# EAGLE design nano relay v2 (EAGLE 9.6.2)
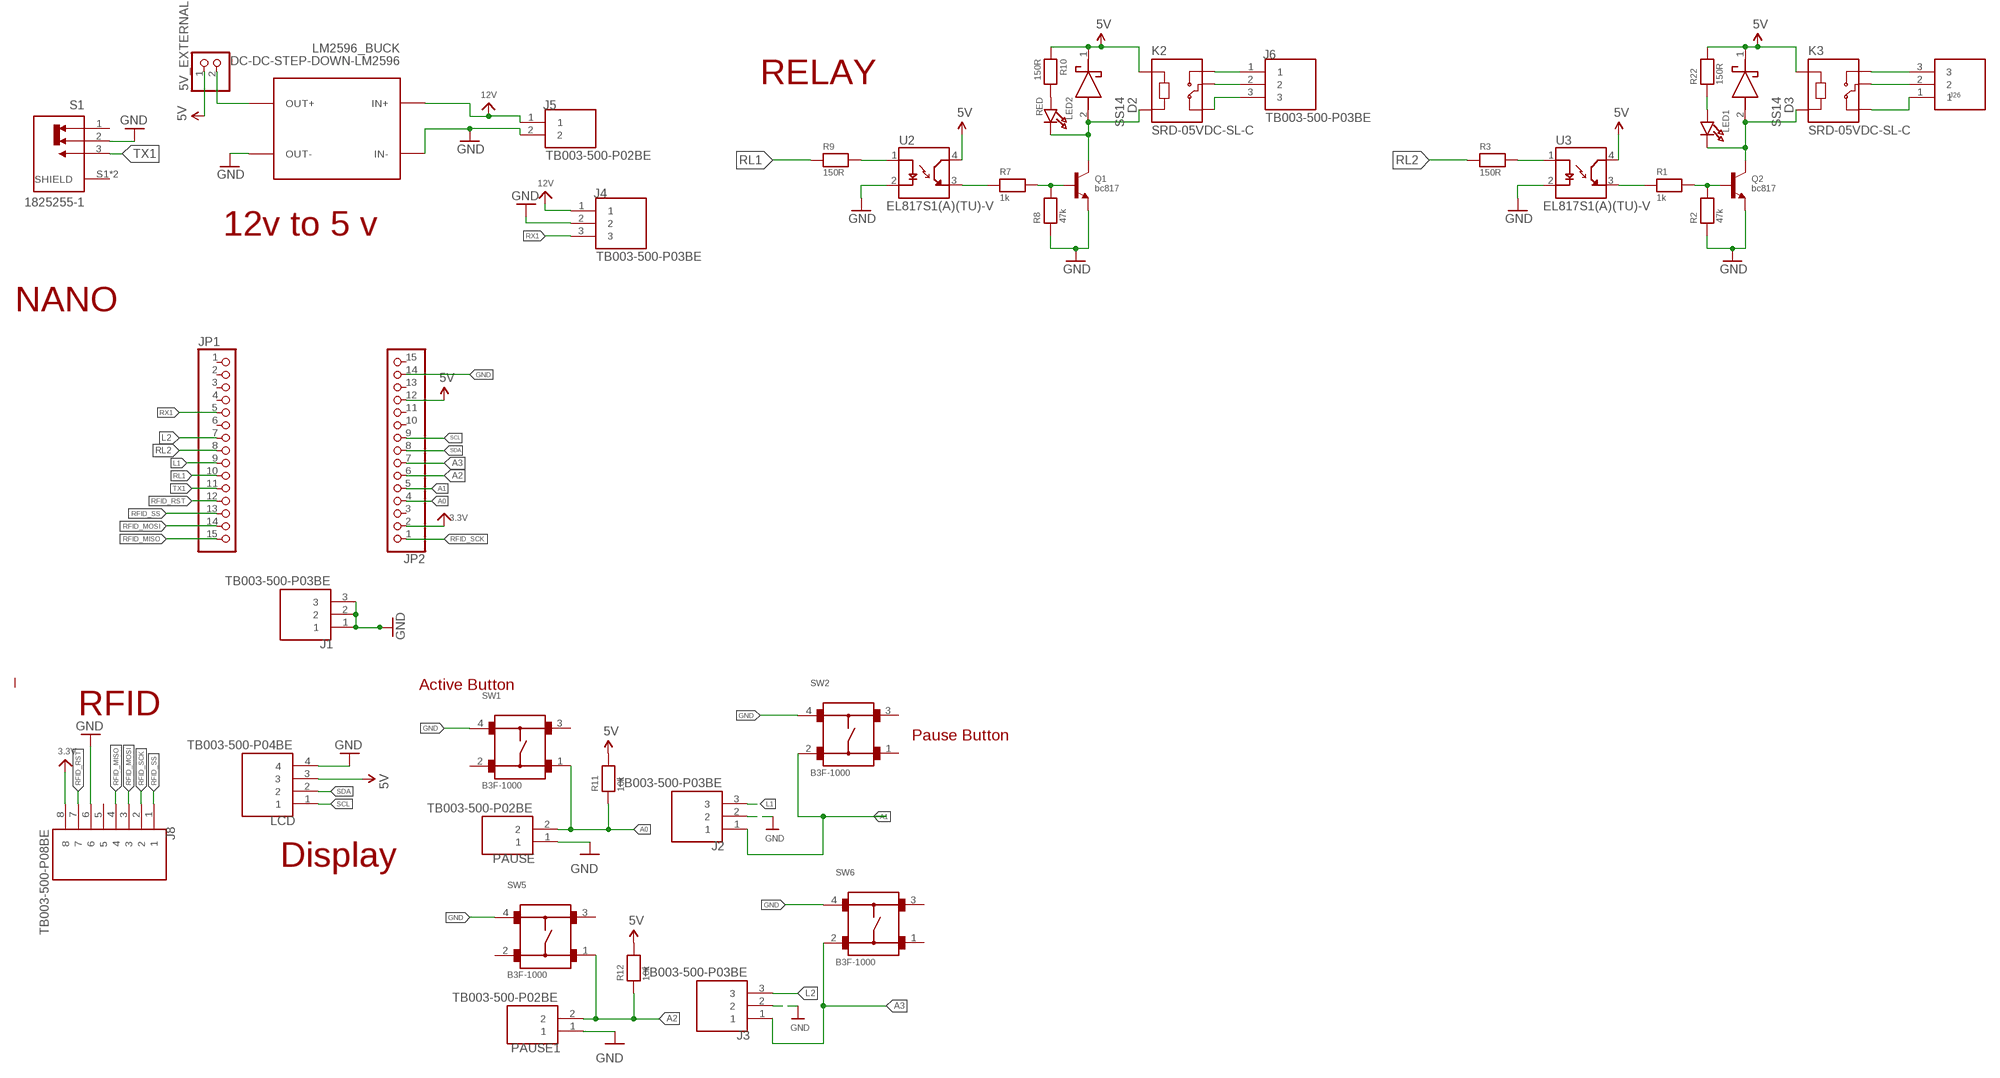
[diagram p0: schematic, sheet 1]

## Parts
5V_EXTERNAL  HEADER-1X2ROUND  [1X02_ROUND]
D2  SS14  [DIOM5227X270N]
D3  SS14  [DIOM5227X270N]
J1  TB003-500-P03BE  [CUI_TB003-500-P03BE]
J2  TB003-500-P03BE  [CUI_TB003-500-P03BE]
J3  TB003-500-P03BE  [CUI_TB003-500-P03BE]
J4  TB003-500-P03BE  [CUI_TB003-500-P03BE]
J5  TB003-500-P02BE  [CUI_TB003-500-P02BE]
J6  TB003-500-P03BE  [CUI_TB003-500-P03BE]
J8  TB003-500-P08BE  [CUI_TB003-500-P08BE]
J26  TB003-500-P03BE  [CUI_TB003-500-P03BE]
JP1  HEADER-1X15  [1X15_ROUND_70]
JP2  HEADER-1X15  [1X15_ROUND_70]
K2  SRD-05VDC-SL-C  [RELAY_SRD-05VDC-SL-C]
K3  SRD-05VDC-SL-C  [RELAY_SRD-05VDC-SL-C]
LCD  TB003-500-P04BE  [CUI_TB003-500-P04BE]
LED1  LED0603  [CHIPLED_0603]
LED2  RED  LED0603  [CHIPLED_0603]
LM2596_BUCK  DC-DC-STEP-DOWN-LM2596  [DC-DC-STEP-DOWN-LM2596]
PAUSE  TB003-500-P02BE  [CUI_TB003-500-P02BE]
PAUSE1  TB003-500-P02BE  [CUI_TB003-500-P02BE]
Q1  bc817  TRANSISTOR_NPN  [SOT23-R]
Q2  bc817  TRANSISTOR_NPN  [SOT23-R]
R1  1k  RESISTOR0603  [0603]
R2  47k  RESISTOR0603  [0603]
R3  150R  RESISTOR0603  [0603]
R7  1k  RESISTOR0603  [0603]
R8  47k  RESISTOR0603  [0603]
R9  150R  RESISTOR0603  [0603]
R10  150R  RESISTOR0402  [0402]
R11  10k  RESISTOR0603  [0603]
R12  10k  RESISTOR0603  [0603]
R22  150R  RESISTOR0402  [0402]
S1  1825255-1  [SW_1825255-1]
SW1  B3F-1000  [B3F-1000]
SW2  B3F-1000  [B3F-1000]
SW5  B3F-1000  [B3F-1000]
SW6  B3F-1000  [B3F-1000]
U2  EL817S1(A)(TU)-V  [SOIC254P1030X390-4N_EL817S1(A)(TU)-V]
U3  EL817S1(A)(TU)-V  [SOIC254P1030X390-4N_EL817S1(A)(TU)-V]

## Nets
3.3V: J8.8 JP2.2
5V: 5V_EXTERNAL.1 D2.1(K) D3.1(K) JP2.12 K2.A1 K3.A1 LCD.3 R10.1 R11.2 R12.2 R22.2 U2.4(CT) U3.4(CT)
12V: J4.1 J5.1 LM2596_BUCK.IN+
A0: JP2.4 PAUSE.2 R11.1 SW1.1
A1: J2.1 JP2.5 SW2.2
A2: JP2.6 PAUSE1.2 R12.1 SW5.1
A3: J3.1 JP2.7 SW6.2
GND: J1.1 J1.2 J1.3 J2.2 J3.2 J4.2 J5.2 J8.6 JP2.14 LCD.4 LM2596_BUCK.IN- LM2596_BUCK.OUT- PAUSE1.1 PAUSE.1 Q1.2(E) Q2.2(E) R2.1 R8.1 S1.2 SW1.4 SW2.4 SW5.4 SW6.4 U2.2(C) U3.2(C)
L1: J2.3 JP1.9
L2: J3.3 JP1.7
N$2: J6.1 K2.NO
N$3: LED2.A R10.2
N$5: J6.2 K2.COM
N$11: D2.2(A) K2.A2 LED2.C Q1.3(C)
N$12: Q1.1(B) R7.2 R8.2
N$13: J6.3 K2.NC
N$14: R7.1 U2.3(ET)
N$15: 5V_EXTERNAL.2 LM2596_BUCK.OUT+
N$16: R9.2 U2.1(A)
N$17: D3.2(A) K3.A2 LED1.C Q2.3(C)
N$18: Q2.1(B) R1.2 R2.2
N$19: J26.3 K3.NO
N$21: R1.1 U3.3(ET)
N$22: R3.2 U3.1(A)
N$23: J26.1 K3.NC
N$24: J26.2 K3.COM
N$45: LED1.A R22.1
RFID_MISO: J8.4 JP1.15
RFID_MOSI: J8.3 JP1.14
RFID_RST: J8.7 JP1.12
RFID_SCK: J8.2 JP2.1
RFID_SS: J8.1 JP1.13
RL1: JP1.10 R9.1
RL2: JP1.8 R3.1
RX1: J4.3 JP1.5
SCL: JP2.9 LCD.1
SDA: JP2.8 LCD.2
TX1: JP1.11 S1.3
Unconnected: J8.5 JP1.1 JP1.2 JP1.3 JP1.4 JP1.6 JP2.3 JP2.10 JP2.11 JP2.13 JP2.15 S1.1 S1.S1(SHIELD) S1.S2(SHIELD) SW1.2 SW1.3 SW2.1 SW2.3 SW5.2 SW5.3 SW6.1 SW6.3

## Notes on the sheet
- RELAY
- 12v to 5 v
- NANO
- Active Button
- RFID
- Pause Button
- Display

## Library data of the parts
5V_EXTERNAL = microbuilder:HEADER-1X2: PIN HEADER
D2 D3 = SS14:SS14: 1.0 A Schottky Barrier Rectifiers Source: Datasheet <http://www.onsemi.com/pub/Collateral/SS19-D.pdf>; DESCRIPTION: 1.0 A Schottky Barrier Rectifiers; HEIGHT: 2.7mm; MANUFACTURER_NAME: ON Semiconductor; MANUFACTURER_PART_NUMBER: SS14; MOUSER_PART_NUMBER: 512-SS14; MOUSER_PRICE-STOCK: https://www.mouser.com/Search/Refine.aspx?Keyword=512-SS14; RS_PART_NUMBER: 7390467P; RS_PRICE-STOCK: http://uk.rs-online.com/web/p/products/7390467P
J1-J4 J6 J26 = TB003-500-P03BE:TB003-500-P03BE: Check prices <https://pricing.snapeda.com/parts/TB003-500-P03BE/CUI%20Devices/view-part?ref=eda>; AVAILABILITY: Good; CUI_PURCHASE_URL: https://www.cuidevices.com/product/interconnect/connectors/terminal-blocks/tb003-500-series?utm_source=snapeda.com&utm_medium=referral&utm_campaign=snapedaBOM; DESCRIPTION: 2~24 Poles, Screw Type, Horizontal, 5.0 Pitch, 26~14 (AWG), Terminal Block Connector; MF: CUI Devices; MP: TB003-500-P03BE; PACKAGE: None; PRICE: None; PURCHASE-URL: https://pricing.snapeda.com/search/part/TB003-500-P03BE/?ref=eda
J5 PAUSE PAUSE1 = TB003-500-P02BE:TB003-500-P02BE: Check prices <https://pricing.snapeda.com/parts/TB003-500-P02BE/CUI%20Devices/view-part?ref=eda>; AVAILABILITY: Good; CUI_PURCHASE_URL: https://www.cuidevices.com/product/interconnect/connectors/terminal-blocks/tb003-500-series?utm_source=snapeda.com&utm_medium=referral&utm_campaign=snapedaBOM; DESCRIPTION: 2~24 Poles, Screw Type, Horizontal, 5.0 Pitch, 26~14 (AWG), Terminal Block Connector; MF: CUI Devices; MP: TB003-500-P02BE; PACKAGE: None; PRICE: None; PURCHASE-URL: https://pricing.snapeda.com/search/part/TB003-500-P02BE/?ref=eda
J8 = TB003-500-P08BE:TB003-500-P08BE: Check prices <https://pricing.snapeda.com/parts/TB003-500-P08BE/CUI%20Devices/view-part?ref=eda>; AVAILABILITY: Good; CUI_PURCHASE_URL: https://www.cuidevices.com/product/interconnect/connectors/terminal-blocks/tb003-500-series?utm_source=snapeda.com&utm_medium=referral&utm_campaign=snapedaBOM; DESCRIPTION: 2~24 Poles, Screw Type, Horizontal, 5.0 Pitch, 26~14 (AWG), Terminal Block Connector; MF: CUI Devices; MP: TB003-500-P08BE; PACKAGE: None; PRICE: None; PURCHASE-URL: https://pricing.snapeda.com/search/part/TB003-500-P08BE/?ref=eda
JP1 JP2 = microbuilder:HEADER-1X15: 1x15 Header
K2 K3 = SRD-05VDC-SL-C:SRD-05VDC-SL-C: 5V Trigger Relay Module For Arduino And Raspberry Pi 5V Trigger Relay Module For Arduino And Raspberry Pi; AVAILABILITY: Unavailable; DESCRIPTION: 5V Trigger Relay Module For Arduino And Raspberry Pi 5V Trigger Relay Module For Arduino And Raspberry Pi; MF: Songle Relay; MP: SRD-05VDC-SL-C; PACKAGE: None; PRICE: None
LCD = TB003-500-P04BE:TB003-500-P04BE: Check prices <https://pricing.snapeda.com/parts/TB003-500-P04BE/CUI%20Devices/view-part?ref=eda>; AVAILABILITY: Good; CUI_PURCHASE_URL: https://www.cuidevices.com/product/interconnect/connectors/terminal-blocks/tb003-500-series?utm_source=snapeda.com&utm_medium=referral&utm_campaign=snapedaBOM; DESCRIPTION: 2~24 Poles, Screw Type, Horizontal, 5.0 Pitch, 26~14 (AWG), Terminal Block Connector; MF: CUI Devices; MP: TB003-500-P04BE; PACKAGE: None; PRICE: None; PURCHASE-URL: https://pricing.snapeda.com/search/part/TB003-500-P04BE/?ref=eda
LED1 LED2 = microbuilder:LED: LED 0603 - 0603 Surface Mount Package 2mA: Green LED - Low Power (3.9mcd, 2ma, 1.7Vf) - Digikey: 475-2709-2-ND Orange LED - Low Power (9.8mcd, 2ma, 1.8Vf) - Digikey: 475-1194-2-ND Red LED - Low Power (5mcd, 2ma, 1.8Vf) - Digikey: 475-1195-2-ND Yellow LED - Low Power (7mcd, 2ma, 1.8Vf) - Digikey: 475-1196-2-ND 5mA: Blue LED - Low Power (17mcd, 5ma, 2.9Vf) - Digikey: LNJ937W8CRACT-ND 0805 - 0805 Surface Mount Package 2mA: Red LED (8.8mcd, 2mA, 1.8Vf, Clear) - Low Power [Digikey: 475-2510-1-ND] Green LED (5mcd, 2mA, 1.8Vf, Clear) - Low Power [Digikey: 475-2730-1-ND] Yellow LED (11.3mcd, 2mA, 1.8Vf, Clear) - Low Power [Digikey: 475-2555-1-ND] 20mA: Red LED (104mcd, 20mA, Diffused) - LS R976 [Digikey: 475-1278-6-ND] Red LED (12mcd, 20mA, 2.0Vf, Clear) - APT2012EC [Digikey: 754-1128-1-ND] Green LED (15mcd, 20mA, 2.2Vf, Clear) - APT2012GC [Digikey: 754-1131-1-ND] Orange LED (160mcd, 20mA, 2.1Vf, Clear) - APT2012SECK [Digikey: 754-1130-1-ND] 1206 - 1206 Surface Mount Package Green LED (26mcd, 20mA, Diffused) - LG N971 [Digikey: 475-1407-6-ND] Red LED (15mcd, 20mA, Diffused) - LH N974 [Digikey: 475-1416-6-ND]
LM2596_BUCK = diy-modules:DC-DC-STEP-DOWN-LM2596: DC/DC Step-Down Regulator based on LM2596-ADJ chip LM2596 datasheet available here: http://www.ti.com/lit/ds/symlink/lm2596.pdf Click here to find device on ebay.com <http://www.ebay.com/sch/lm2596+power+regulator>
Q1 Q2 = microbuilder:TRANSISTOR_NPN: NPN Transistor Transistor (NPN) 500mA 45V - BC817 [Digikey: 568-1631-1-ND] Transistor (NPN) 500mA 45V - BC817,215 [Mouser: 771-BC817-T/R] SOT23-R - SOT23 footprint optimised for use with solder paste and reflow ovens. SOT23-W - SOT23 footprint optimised for hand-soldering (larger pads).
R1-R3 R7-R12 R22 = microbuilder:RESISTOR: Resistors 0402 - 0402 Surface Mount Package 22 Ohm 1% 1/16W [Digikey: 311-22.0LRTR-ND] 33 Ohm 5% 1/16W 1.0K 5% 1/16W 1.5K 5% 1/16W 2.0K 1% 1/16W 10.0K 1% 1/16W [Digikey: 311-10.0KLRTR-ND] 10.0K 5% 1/16W [Digikey: RMCF0402JT10K0TR-ND] 12.1K 1% 1/16W [Digikey: 311-22.0LRTR-ND] 100.0K 5% 1/16W 0603 - 0603 Surface Mount Package 0 Ohm 1/10 Watt 1% Resistor 15 Ohm 1/10 Watt 1% Resistor 33 Ohm 1/10 Watt 1% Resistor 49.9 Ohm 1/10 Watt 1% Resistor 100 Ohm 1/10 Watt 1% Resistor 150 Ohm 1/10 Watt 1% Resistor 240 Ohm 1/10 Watt 1% Resistor 390 Ohm 1/10 Watt 1% Resistor 560 Ohm 1/10 Watt 1% Resistor 680 Ohm 1/10 Watt 1% Resistor 750 Ohm 1/10 Watt 1% Resistor 1.0K Ohm 1/10 Watt 1% Resistor 1.5K Ohm 1/10 Watt 1% Resistor 2.0K Ohm 1/10 Watt 1% Resistor 2.2K Ohm 1/10 Watt 1% Resistor 3.3K Ohm 1/10 Watt 1% Resistor 4.7K Ohm 1/10 Watt 1% Resistor 10.0K Ohm 1/10 Watt 1% Resistor 12.0K Ohm 1/10 Watt 1% Resistor 12.1K Ohm 1/10 Watt 1% Resistor 20.0K Ohm 1/10 Watt 1% Resistor 33.0K Ohm 1/10 Watt 1% Resistor 100.0K Ohm 1/10 Watt 1% Resistor 0805 - 0805 Surface Mount Package 0 Ohm 1/8 Watt 1% Resistor 33 Ohm 1/8 Watt 1% Resistor 100 Ohm 1/8 Watt 1% Resistor 150 Ohm 1/8 Watt 1% Resistor 200 Ohm 1/8 Watt 1% Resistor 240 Ohm 1/8 Watt 1% Resistor 330 Ohm 1/8 Watt 1% Resistor 390 Ohm 1/8 Watt 1% Resistor 470 Ohm 1/8 Watt 1% Resistor 1.0K Ohm 1/8 Watt 1% Resistor 1.5K Ohm 1/8 Watt 1% Resistor 2.0K Ohm 1/8 Watt 1% Resistor 4.7K Ohm 1/8 Watt 1% Resistor 5.1K Ohm 1/8 Watt 1% Resistor 5.6K Ohm 1/8 Watt 1% Resistor 10.0K Ohm 1/8 Watt 1% Resistor 22.0K Ohm 1/8 Watt 1% Resistor 33.0K Ohm 1/8 Watt 1% Resistor 100K Ohm 1/8 Watt 1% Resistor 1206 - 1206 Surface Mount Package 2012 - 2010 Surface Mount Package 0.11 Ohm 1/2 Watt 1% Resistor - Digikey: RHM.11UCT-ND
S1 = 1825255-1:1825255-1: Switch Slide ON None ON SPDT Top Slide 0.3A 125VAC PC Pins Thru-Hole Tray; COMMENT: 1825255-1; DESCRIPTION: Switch Slide ON None ON SPDT Top Slide 0.3A 125VAC PC Pins Thru-Hole Tray; DIGI-KEY_PART_NUMBER: 450-1567-ND; MF: TE Connectivity; MP: 1825255-1; PACKAGE: Custom Package TE Connectivity; PURCHASE-URL: https://pricing.snapeda.com/search/part/1825255-1/?ref=eda
SW1 SW2 SW5 SW6 = Switch:B3F-1000: Tactile Switch SPST-NO Top Actuated Through Hole Manufacturer's datasheet <https://omronfs.omron.com/en_US/ecb/products/pdf/en-b3f.pdf>; CREATED_BY: PCBLayout.com; DIGI_KEY_PART_NUMBER: SW400-ND; MANUFACTURER: Omron Electronics Inc-EMC Div; MPN: B3F-1000; PACKAGE: SPST-NO
U2 U3 = EL817S1_A__TU_-V:EL817S1(A)(TU)-V: Optoisoltr 5kv Transistor 4-Smd; DESCRIPTION: Optoisolator Transistor Output 5000Vrms 1 Channel 4-SMD; DIGI-KEY_PART_NUMBER: EL817S1(A)(TU)-V-ND; MF: Everlight Electronics; MP: EL817S1(A)(TU)-V; PACKAGE: SMD-4 Everlight Electronics Co Ltd

## Net classes
0 default: width 0.203 mm, drill 0.406 mm, clearance 0.203 mm

## Board
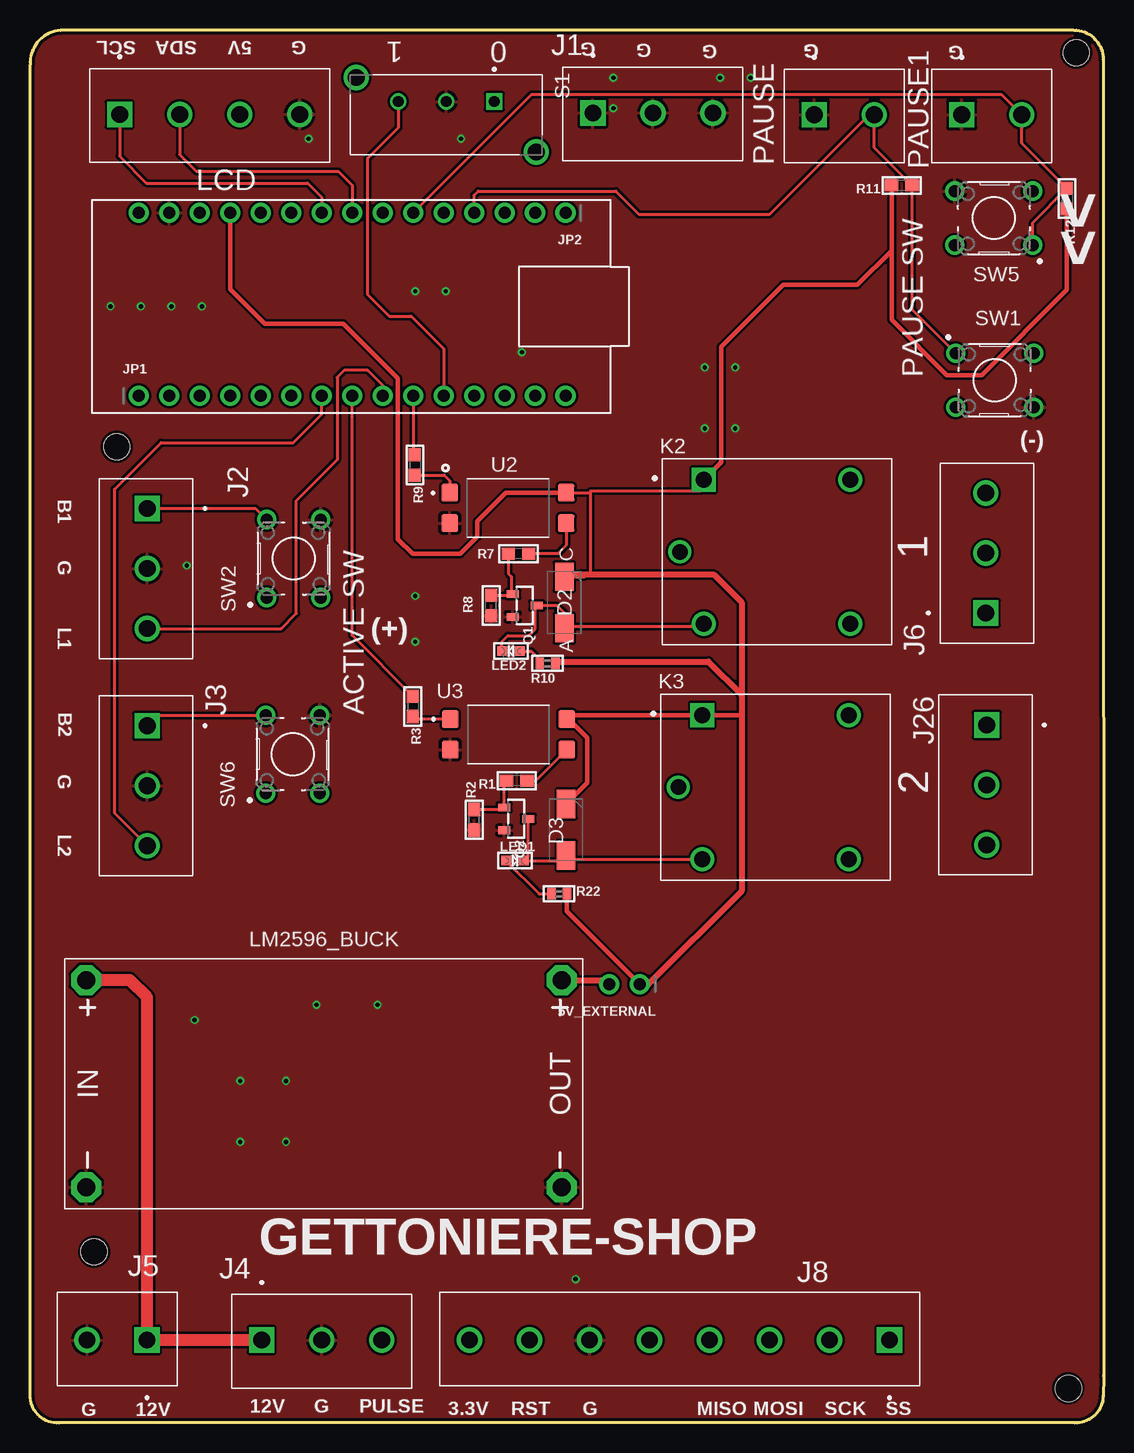
[diagram p1: board, top side]
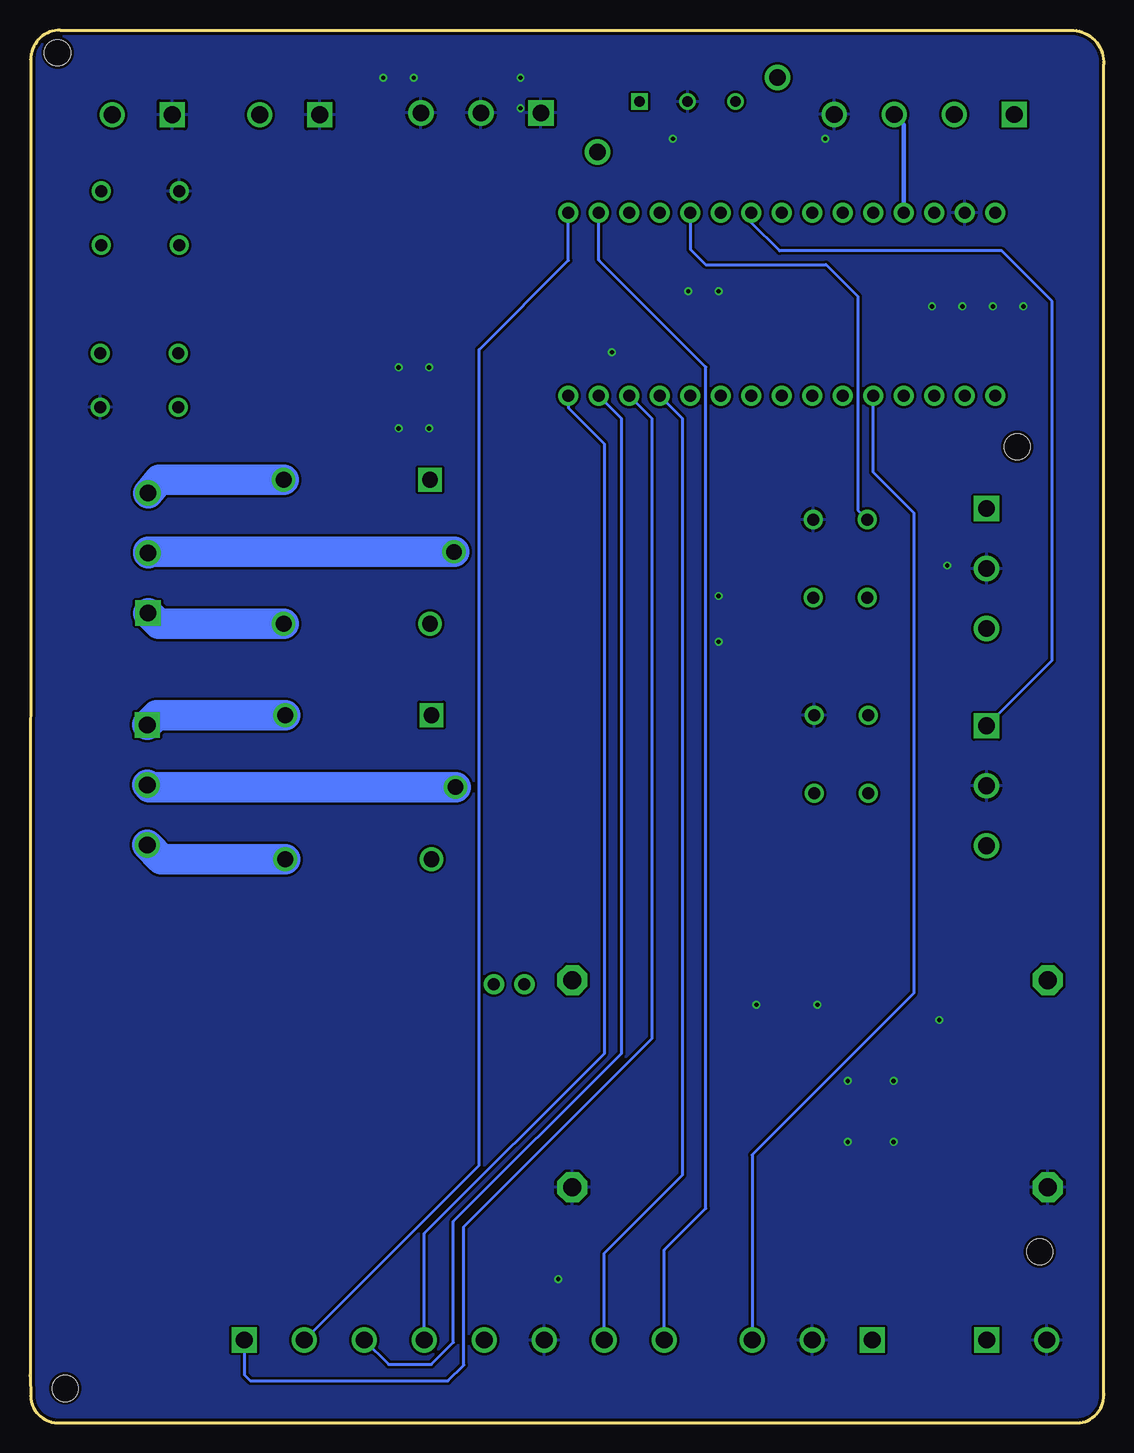
[diagram p2: board, bottom side, seen from below]

Size 89.49 x 116.08 mm. Coordinates in mm from the lower left corner, seen from the top.
Outline: 0.03,2.09 arc89 2.41,0 87.05,0 arc90 89.43,2.24 89.46,3.86 arc90 89.46,4.02 89.43,113.62 arc90 86.97,116.08 2.54,116.05 arc90 0.03,113.18 0.03,2.09
Outline: 0.03,2.09 arc-1 0,2.47
Copper layers (1*16): Top 0.035mm / dielectric 1.5mm / Bottom 0.035mm
Design rules "default *": minimum track width 8mil, minimum drill 0.3mm, track to track 6mil, track to pad 6mil, pad to pad 6mil, via to via 6mil, smd to smd 0mil, copper to edge 10mil, drill to drill 6mil, minimum pad ring 8mil, minimum via ring 6mil, stop-mask expansion 2mil, vias tented up to drill 15mil, thermal gap 10mil
Holes 2.16 mm at 86.54,2.87 87.2,114.2 5.33,14.28 7.21,81.36

### Footprints (pad centres in the part's own frame; a part is rotated, then mirrored left to right if it is on the bottom)
1X02_ROUND = drill 1 pad 1.676: 1 -1.27,0; 2 1.27,0
DIOM5227X270N = smd 2.35 x 1.55: 1 -2.15,0; 2 2.15,0
CUI_TB003-500-P03BE = drill 1.4 square: 1 0,0 | drill 1.4: 2 5,0; 3 10,0
CUI_TB003-500-P02BE = drill 1.4 square: 1 0,0 | drill 1.4: 2 5,0
CUI_TB003-500-P08BE = drill 1.4 square: 1 0,0 | drill 1.4: 2 5,0; 3 10,0; 4 15,0; 5 20,0; 6 25,0; 7 30,0; 8 35,0
1X15_ROUND_70 = drill 1 pad 1.676: 1 -17.78,0; 2 -15.24,0; 3 -12.7,0; 4 -10.16,0; 5 -7.62,0; 6 -5.08,0; 7 -2.54,0; 8 0,0; 9 2.54,0; 10 5.08,0; 11 7.62,0; 12 10.16,0; 13 12.7,0; 14 15.24,0; 15 17.78,0
RELAY_SRD-05VDC-SL-C = drill 1.32 square: A1 -6.1,6 | drill 1.32: A2 -6.1,-6; NC 6.1,6; NO 6.1,-6 | drill 1.29: COM -8.1,0
CUI_TB003-500-P04BE = drill 1.4 square: 1 0,0 | drill 1.4: 2 5,0; 3 10,0; 4 15,0
CHIPLED_0603 = smd 0.8 x 0.8: A 0,-0.75; C 0,0.75
DC-DC-STEP-DOWN-LM2596 = drill 1.5 pad 2.5 octagon: IN+ -19.812,8.636; IN- -19.812,-8.636; OUT+ 19.812,8.636; OUT- 19.812,-8.636
SOT23-R = smd 0.635 x 1.016: 1 -0.95,-1; 2 0.95,-1; 3 0,1
0603 = smd 1.1 x 1: 1 -0.85,0; 2 0.85,0
0402 = smd 0.7 x 0.9: 1 -0.65,0; 2 0.65,0
SW_1825255-1 = drill 0.902 square: 1 -1.1,4 | drill 0.902: 2 -1.1,0; 3 -1.1,-4 | drill 1.402: S1 3.1,7.5; S2 -3.1,-7.5
B3F-1000 = drill 1 pad 1.6: 1 -3.25,2.25; 2 3.25,2.25; 3 -3.25,-2.25; 4 3.25,-2.25
SOIC254P1030X390-4N_EL817S1(A)(TU)-V = smd 1.41 x 1.47: 1 -4.85,1.27; 2 -4.85,-1.27; 3 4.85,-1.27; 4 4.85,1.27

### Placement (x,y rotation side)
5V_EXTERNAL  49.56,36.55 180 top
D2  44.53,68.38 270 top
D3  44.68,49.43 270 top
J1  46.91,109.17 0 top
J2  9.78,76.2 270 top
J3  9.78,58.09 270 top
J4  19.3,6.91 0 top
J5  9.75,6.91 180 top
J6  79.65,67.49 90 top
J8  71.63,6.91 180 top
J26  79.73,58.17 270 top
JP1  26.85,85.6 0 top
JP2  26.85,100.84 180 top
K2  62.26,72.6 0 top
K3  62.13,52.99 0 top
LCD  7.47,109.04 0 top
LED1  40.41,46.87 270 top
LED2  40.08,64.31 90 top
LM2596_BUCK  24.49,28.27 0 top
PAUSE  65.35,109.02 0 top
PAUSE1  77.65,109.02 0 top
Q1  41.22,68.12 270 top
Q2  40.51,50.34 270 top
R1  40.56,53.52 180 top
R2  37.03,50.27 90 top
R3  31.9,59.72 270 top
R7  40.72,72.44 180 top
R8  38.43,68.12 90 top
R9  32.08,79.83 270 top
R10  43.13,63.3 180 top
R11  72.64,103.13 180 top
R12  86.41,102.03 270 top
R22  44.09,44.1 0 top
S1  34.7,109.02 270 top
SW1  80.39,86.9 0 top
SW2  21.97,72.04 90 top
SW5  80.31,100.41 180 top
SW6  21.89,55.73 90 top
U2  39.83,76.25 0 top
U3  39.88,57.38 0 top

### Tracks (layer width: path | path; a pad name or v marks a point on that pad's centre or on a via)
3.3V
  Bottom 0.254: J8.8 36.63,14.43 33.17,17.88 33.17,87.99 42.09,96.9 JP2.2
5V
  Top 0.254: U2.4 46.71,77.52 | K2.A1 56.16,77.9 55.93,77.68 46.71,77.68 46.71,77.52 | D2.1 44.96,70.53 46.24,70.53 46.71,71 46.71,77.52
  Top 0.381: K2.A1 57.6,80.04 57.6,89.69 62.76,94.85 68.94,94.85 71.79,97.7 | 71.79,103.19 R11.2 71.79,97.7 | JP2.12 16.69,94.46 19.56,91.59 26.11,91.59 30.66,87.05 30.66,73.66 31.88,72.44 35.84,72.44 37.26,73.87 37.26,75.14 39.65,77.52 U2.4 | R22.2 44.74,42.63 5V_EXTERNAL.1 | D3.1 46.46,53.36 46.46,57.1 44.91,58.65 U3.4 45.06,58.99 K3.A1 59.23,58.99 59.31,58.9 | R12.2 86.41,94.41 79.32,87.33 76.4,87.33 71.79,91.94 71.79,97.7
  Top 0.508: 59.31,60.68 59.31,58.9 59.31,44.33 51.54,36.55 5V_EXTERNAL.1 51.05,36.55 | 44.96,70.53 45.11,70.68 57.01,70.68 59.31,68.38 59.31,60.68 | R10.1 43.93,63.45 56.54,63.45 59.31,60.68
  Bottom 0.254: LCD.3 17.47,108.97
  Bottom 0.381: JP2.12 16.69,108.19 17.47,108.97
12V
  Top 1.016: J4.1 J5.1 9.75,35.46 8.31,36.91 LM2596_BUCK.IN+
A0
  Top 0.254: SW1.1 73.49,92.79 R11.1 70.35,106.27 PAUSE.2 69.95,109.02 61.65,100.71 50.75,100.71 48.82,102.64 37.34,102.64 37.01,102.31 JP2.4
A1
  Top 0.254: J2.1 18.81,76.2 SW2.2
  Bottom 0.254: JP2.5 34.47,97.79 33.2,96.52 23.14,96.52 20.5,93.88 20.5,76.06 SW2.2
A2
  Top 0.254: SW5.1 83.56,100.04 R12.1 82.65,106.65 PAUSE1.2 80.97,110.7 41.78,110.7 JP2.6
A3
  Top 0.254: J3.1 10.67,58.98 SW6.2
  Bottom 0.254: J3.1 4.32,63.55 4.32,93.47 8.51,97.67 27.03,97.67 29.39,100.03 JP2.7
GND  (via drill 0.36)
  other vias: 6.71,93.04 9.25,93.04 11.79,93.04 14.33,93.04 32.11,94.31 34.65,94.31 56.24,87.96 58.78,87.96 48.62,112.09 48.62,109.55 41,89.23 32.11,65.1 32.11,68.91 56.24,82.88 58.78,82.88 17.53,23.42 21.34,23.42 23.88,34.85 28.96,34.85 45.47,11.99 17.53,28.5 21.34,28.5 13.72,33.58 13.06,71.45 23.22,107.01 35.92,107.01 60.05,112.09 57.51,112.09
  pour Top: -0.51,0.03 89.56,0.03 89.56,116.13 -0.51,116.13
  pour Bottom: 89.56,0 89.56,116.18 -0.53,116.18 -0.53,0
L1
  Top 0.254: J2.3 20.94,66.2 22.2,67.46 22.2,76.86 25.6,80.27 25.6,87.12 26.19,87.71 28.14,87.71 29.39,86.46 JP1.9
L2
  Top 0.254: J3.3 7.06,50.81 7.06,77.83 10.92,81.69 21.95,81.69 24.31,84.05 JP1.7
N$2
  Bottom 2.54: K2.NO 78.76,66.6 J6.1
N$3
  Top 0.254: LED2.A 41.76,64.32 42.48,63.59 R10.2
N$5
  Bottom 2.54: K2.COM 79.63,72.6 J6.2
N$11
  Top 0.254: D2.2 44.58,66.23 44.58,66.38 | 44.58,66.38 55.94,66.38 K2.A2 | Q1.3 42.24,68.13 | 42.24,68.13 43.92,68.13 44.58,67.46 44.58,66.38 | LED2.C 39.33,65.11 39.83,65.61 41.55,65.61 42.09,66.14 42.09,67.97 42.24,68.13
N$12
  Top 0.254: R8.2 40.12,68.98 | 40.12,68.98 Q1.1 | R7.2 39.87,70.78 40.12,70.52 40.12,68.98
N$13
  Bottom 2.54: K2.NC 78.71,78.6 J6.3
N$14
  Top 0.254: U2.3 44.68,73.13 43.99,72.44 R7.1
N$15
  Top 0.508: LM2596_BUCK.OUT+ 47.93,36.91 5V_EXTERNAL.2
N$16
  Top 0.254: R9.2 34.5,78.98 34.98,78.51 U2.1
N$17
  Top 0.254: 44.26,46.87 LED1.C 41.51,47.22 Q2.3 | K3.A2 44.97,46.99 44.89,47.07
  Top 0.381: 44.89,47.07 D3.2 44.26,46.87
N$18
  Top 0.254: R2.2 39.34,51.12 Q2.1 39.51,53.32 R1.2
N$19
  Bottom 2.54: K3.NO 78.55,46.99 J26.3
N$21
  Top 0.254: R1.1 42.14,53.52 U3.3
N$22
  Top 0.254: U3.1 32.12,58.65 R3.2
N$23
  Bottom 2.54: K3.NC 78.91,58.99 J26.1
N$24
  Bottom 2.54: K3.COM 79.55,52.99 J26.2
N$45
  Top 0.254: LED1.A 42.43,44.1 R22.1
RFID_MISO
  Bottom 0.254: J8.4 56.63,15.79 41.65,30.77 41.65,81.61 44.63,84.58 JP1.15
RFID_MOSI
  Bottom 0.254: J8.3 59.6,4.88 56.03,4.88 54.2,6.71 54.2,16.79 40.21,30.79 40.21,83.72 JP1.14
RFID_RST
  Bottom 0.254: J8.7 41.63,14.15 35.13,20.65 35.13,83.72 JP1.12
RFID_SCK
  Bottom 0.254: J8.2 52.07,21.47 52.07,89.44 44.63,96.88 JP2.1
RFID_SS
  Bottom 0.254: J8.1 71.63,4.02 71.12,3.51 54.66,3.51 53.34,4.83 53.34,16.36 37.67,32.03 37.67,83.72 JP1.13
RL1
  Top 0.254: JP1.10 31.93,80.84 R9.1
RL2
  Top 0.254: R3.1 26.85,65.62 JP1.8
RX1
  Bottom 0.254: JP1.5 19.23,79.24 15.85,75.86 15.85,35.79 29.3,22.34 J4.3
SCL
  Top 0.254: LCD.1 7.47,105.56 9.7,103.33 23.14,103.33 24.31,102.16 JP2.9
SDA
  Top 0.254: LCD.2 12.47,105.7 13.87,104.29 25.7,104.29 26.85,103.15 JP2.8
TX1
  Top 0.254: JP1.11 34.47,89.51 31.75,92.23 29.95,92.23 28.12,94.06 28.12,105.36 30.7,107.94 S1.3

### Text on the board
tPlace: << | (-) | C | 1 | (+) | A | 2
tNames: SCL | SDA | 5V | G | 1 | 0 | G | G | G | G | G | G | PAUSE SW | B1 | G | L1 | B2 | ACTIVE SW | G | L2 | GETTONIERE-SHOP | G | 12V | 12V | G | PULSE | 3.3V | RST | G | MISO | MOSI | SCK | SS